# EasyEDA schematic Mainboard-Easyeda-source.json
TITLE: Digital Thermostat; REV: 1.0; Date: 2017-03-05; Sheet: 1/1; Drawn By: danny-andersen
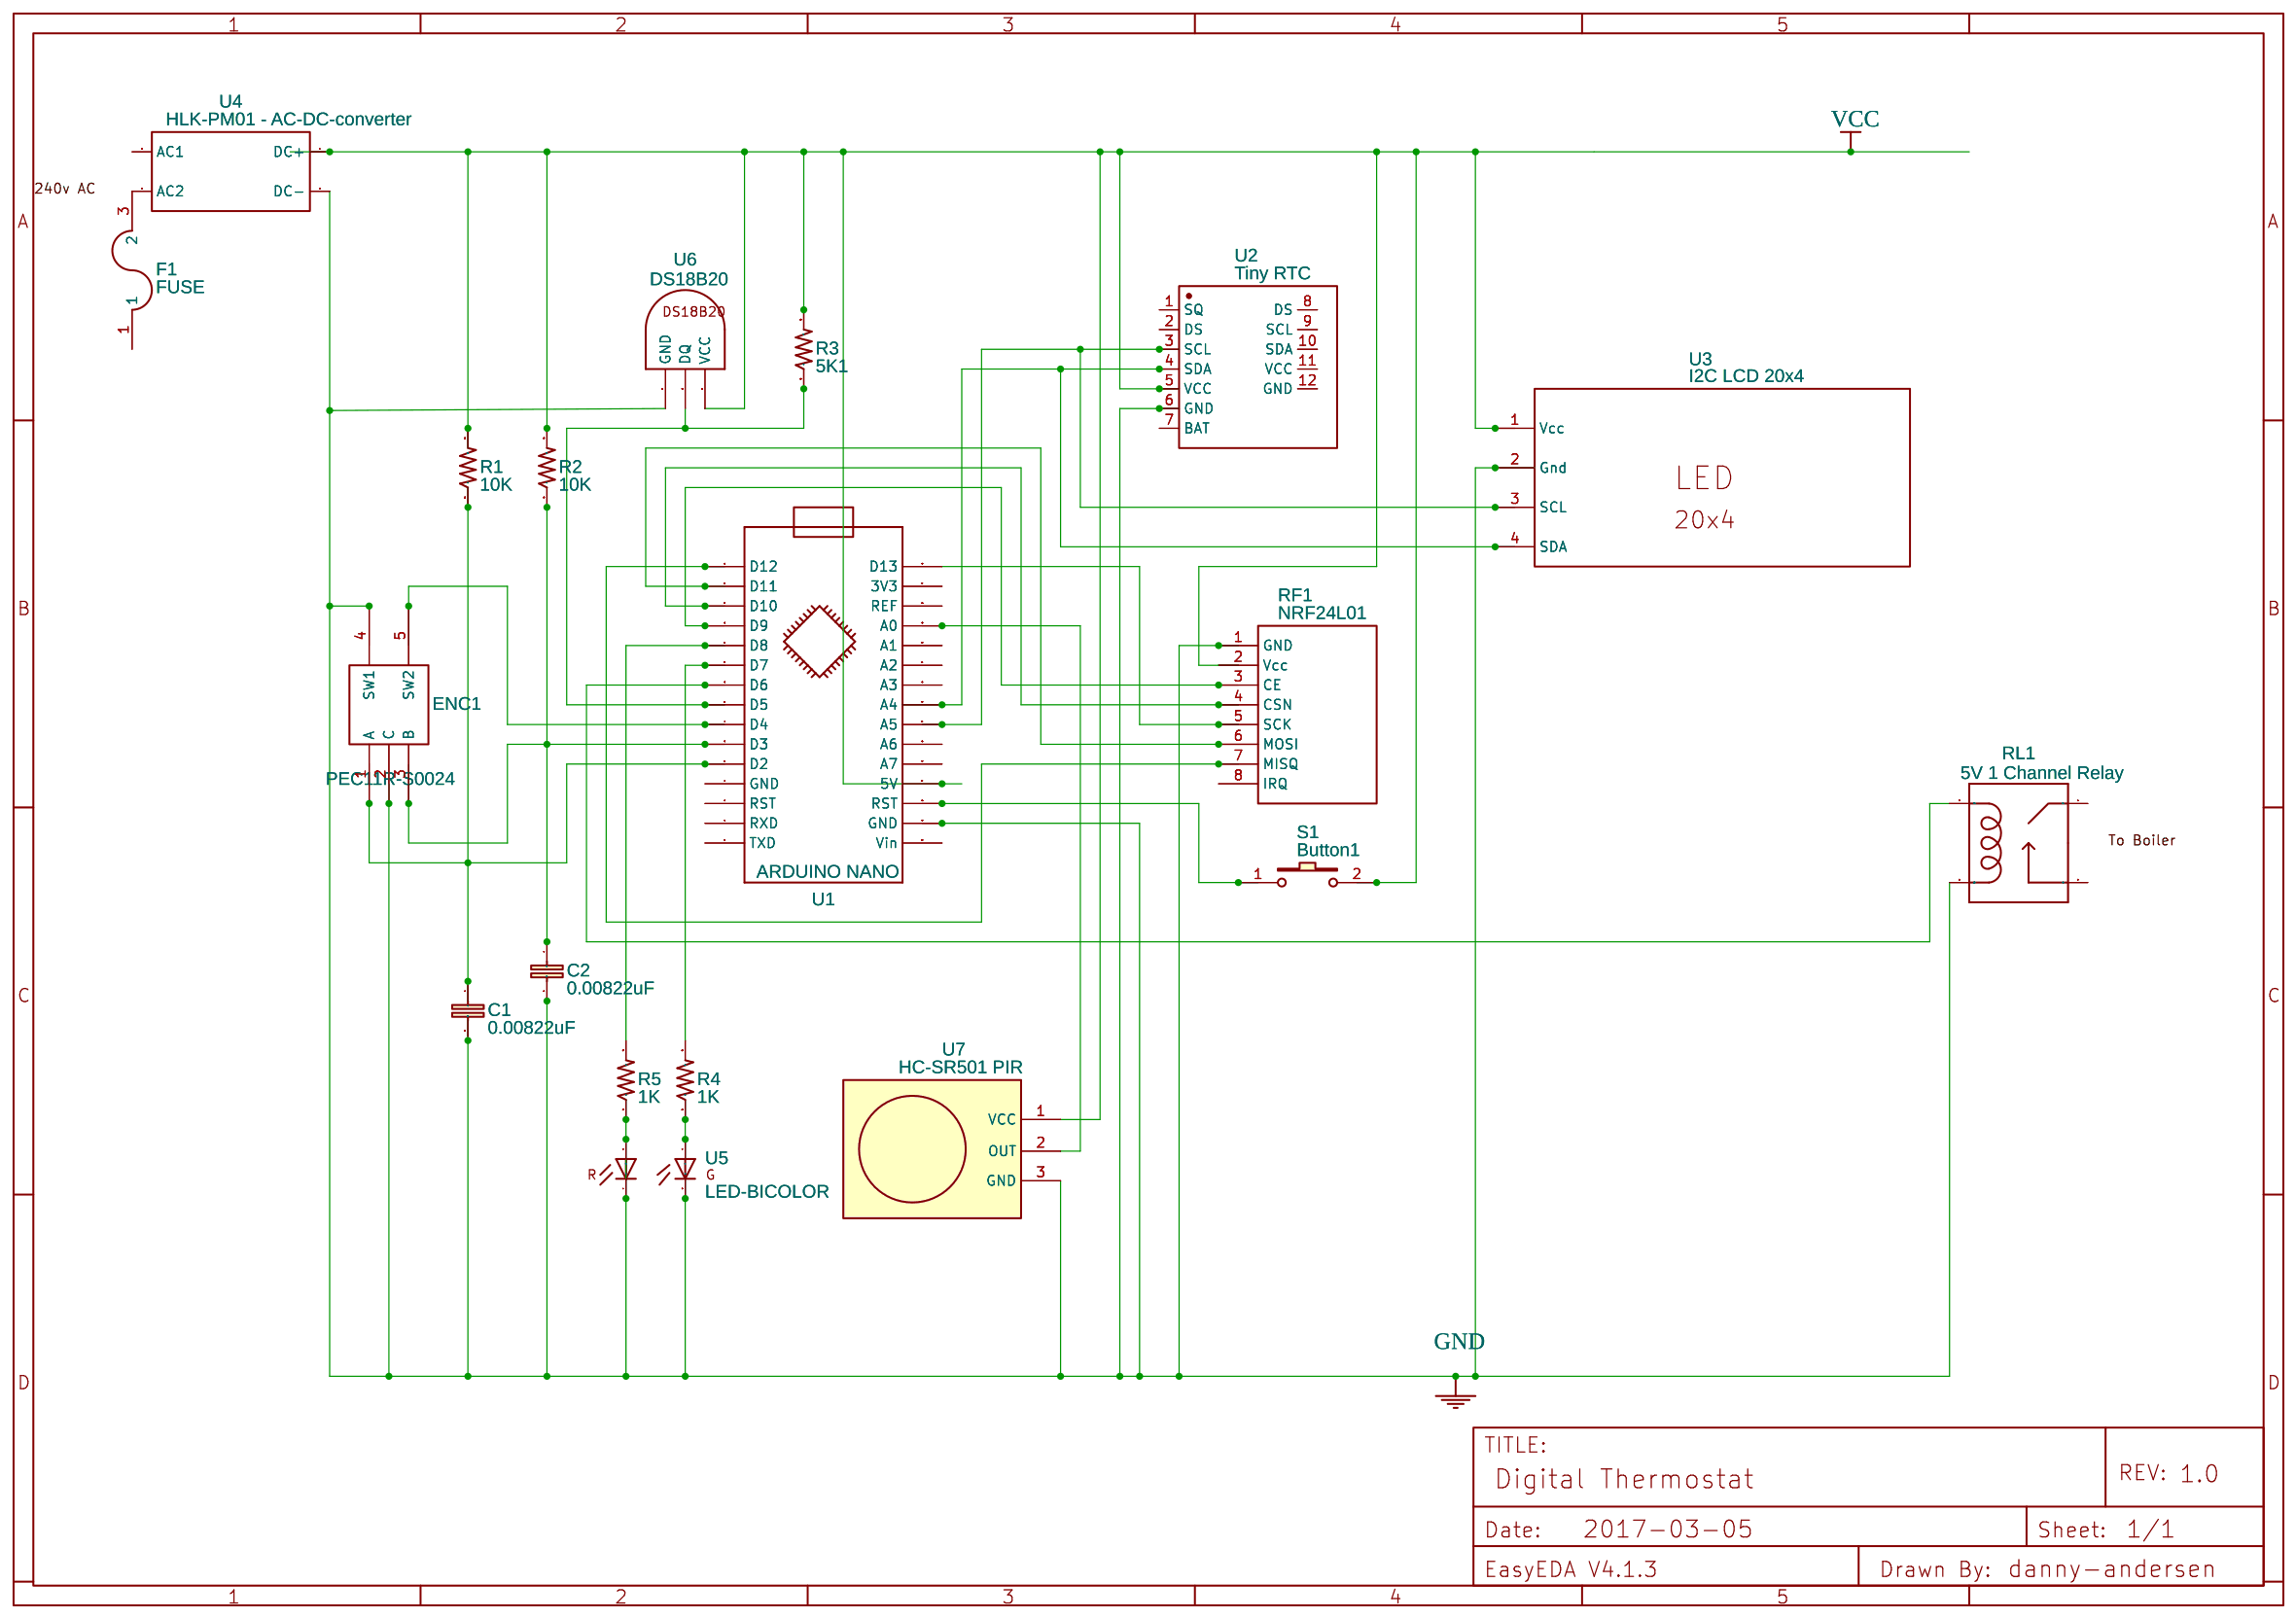
[diagram p0: schematic sheet]

## Parts
C1  0.00822uF  [C402]
C2  0.00822uF  [C402]
ENC1  PEC11R-S0024  [PEC11R-S]
F1  FUSE  [FUSE_5MM]
R1  10K  [AXIAL-0.4]
R2  10K  [AXIAL-0.4]
R3  5K1  [AXIAL-0.4]
R4  1K  [AXIAL-0.4]
R5  1K  [AXIAL-0.4]
RF1  NRF24L01  [HDR2X4]
RL1  5V 1 Channel Relay  [Omron_G5LE_SPST_Relay]
S1  Button1  [2 MIL PUSH BUTTON]
U1  ARDUINO NANO  [ARDUINO_NANO]
U2  Tiny RTC  [Tiny RTC Module]
U3  I2C LCD 20x4  [DIP]
U4  HLK-PM01 - AC-DC-converter  [HLK-PM01]
U5  LED-BICOLOR  [LED-BICOLOR]
U6  DS18B20  [DS18B20_SOIC]
U7  HC-SR501 PIR

## Library data of the parts
C1 C2 = -: Non-Polarized capacitor in various packages; catid: 20; Contributor: DangerousPrototype; Manufacturer Part: ?
ENC1 RL1 U6 = -: catid: 20; Manufacturer Part: ?
F1 R1-R5 = -: catid: 20; Contributor: SparkFun; Manufacturer Part: ?
RF1 = -: Contributor: bungo; sourceId: Oe82VdvNH; Manufacturer Part: ?
S1 = -: catid: 20; sourceId: K60iAuM3l; Manufacturer Part: ?
U1 = -: catid: 20; sourceId: g2wyehQ7j; Manufacturer Part: ?
U2 = -: Manufacturer Part: ?
U3 = -: Contributor: Valery+De+Smedt; sourceId: VlDxP71jB; Manufacturer Part: ?
U4 = -: catid: 20; sourceId: u1BzxTRca; Manufacturer Part: ?
U5 = -: LED-Bicolor  RedGreen; catid: 20; Contributor: Pinoccio; Manufacturer Part: ?
U7 = -: Contributor: exersizze; sourceId: COI0iASar; Manufacturer Part: ?

## Nets
GND: C1.2 C2.2 ENC1.2(C) ENC1.4(SW1) R5.P$1(1) RF1.1(GND) RL1.5(COIL1) U1.29(GND) U2.6(GND) U3.2(Gnd) U4.3(DC-) U5.2 U5.3 U5.4 U6.GND U7.3(GND)
VCC: R1.P$2(2) R2.P$2(2) R3.P$2(2) RF1.2(Vcc) S1.2 U1.27(5V) U2.5(VCC) U3.1(Vcc) U4.4(DC+) U6.VCC U7.1(VCC)
Net-(C1-1): C1.1 ENC1.1(A) R1.P$1(1) U1.5(D2)
Net-(C2-1): C2.1 ENC1.3(B) R2.P$1(1) U1.6(D3)
Net-(ENC1-5): ENC1.5(SW2) U1.7(D4)
Net-(F1-3): F1.3(2) U4.2(AC2)
Net-(R3-P$1): R3.P$1(1) U1.8(D5) U6.DQ
Net-(R4-P$1): R4.P$1(1) U5.1
Net-(R4-P$2): R4.P$2(2) U1.10(D7)
Net-(R5-P$2): R5.P$2(2) U1.11(D8)
Net-(RF1-3): RF1.3(CE) U1.12(D9)
Net-(RF1-4): RF1.4(CSN) U1.13(D10)
Net-(RF1-5): RF1.5(SCK) U1.16(D13)
Net-(RF1-6): RF1.6(MOSI) U1.14(D11)
Net-(RF1-7): RF1.7(MISQ) U1.15(D12)
Net-(RL1-2): RL1.2(COIL2) U1.9(D6)
Net-(S1-1): S1.1 U1.28(RST)
Net-(U1-19): U1.19(A0) U7.2(OUT)
Net-(U1-23): U1.23(A4) U2.4(SDA) U3.4(SDA)
Net-(U1-24): U1.24(A5) U2.3(SCL) U3.3(SCL)

Not connected (* = marked no-connect by the designer): F1 1; RF1 8(IRQ); RL1 1(MAIN) 3(NO); U1 1(TXD) 2(RXD) 3(RST) 4(GND) 17(3V3) 18(REF) 20(A1) 21(A2) 22(A3) 25(A6) 26(A7) 30(Vin); U2 1(SQ) 2(DS) 7(BAT) 8(DS) 9(SCL) 10(SDA) 11(VCC) 12(GND); U4 1(AC1)
